# EAGLE design PiLight (EAGLE 6.4)
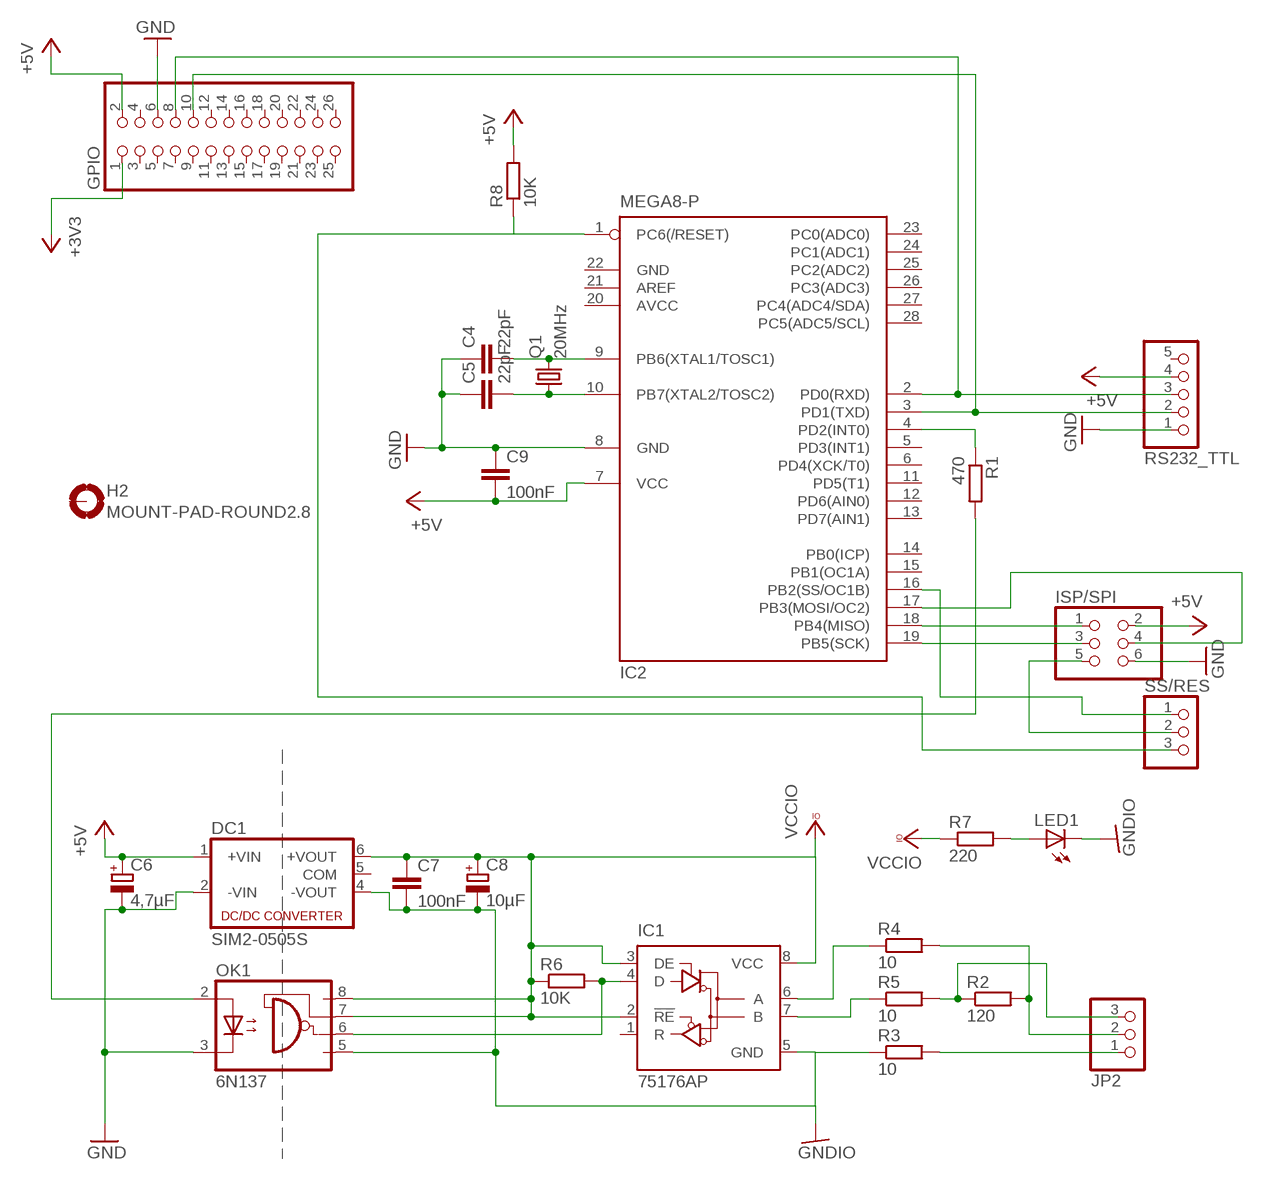
[diagram p0: schematic, sheet 1]

## Parts
C4  22pF  C-EU025-025X050  [C025-025X050]
C5  22pF  C-EU025-025X050  [C025-025X050]
C6  4,7µF  CPOL-EUE2.5-5  [E2,5-5]
C7  100nF  C-EU025-025X050  [C025-025X050]
C8  10µF  CPOL-EUE2.5-5  [E2,5-5]
C9  100nF  C-EU025-025X050  [C025-025X050]
DC1  SIM2-0505S  NMA  [NMA]
GPIO  PINHD-2X13  [2X13]
H2  MOUNT-PAD-ROUND2.8  [2,8-PAD]
IC1  75176AP  [DIL08]
IC2  MEGA8-P  [DIL28-3]
ISP/SPI  PINHD-2X3  [2X03]
JP2  PINHD-1X3  [1X03]
LED1  LED3MM  [LED3MM]
OK1  6N137  [DIL08]
Q1  20MHz  CRYSTALHC49S  [HC49/S]
R1  470  R-EU_0207/10  [0207/10]
R2  120  R-EU_0207/10  [0207/10]
R3  10  R-EU_0207/10  [0207/10]
R4  10  R-EU_0207/10  [0207/10]
R5  10  R-EU_0207/10  [0207/10]
R6  10K  R-EU_0207/10  [0207/10]
R7  220  R-EU_0207/10  [0207/10]
R8  10K  R-EU_0207/10  [0207/10]
RS232_TTL  PINHD-1X5  [1X05]
SS/RES  PINHD-1X3  [1X03]

## Nets
+3V3: GPIO.1
+5V: C6.+ C9.2 DC1.1(+VIN) GPIO.2 IC2.7(VCC) ISP/SPI.2 R8.2 RS232_TTL.4
GND: C4.1 C5.1 C6.- C9.1 DC1.2(-VIN) GPIO.6 IC2.8(GND) ISP/SPI.6 OK1.3(C) RS232_TTL.1
GNDIO: C7.2 C8.- DC1.4(-VOUT) IC1.5(GND) LED1.K(C) OK1.5(GND) R3.1
N$1: IC2.1(PC6(/RESET)) R8.1 SS/RES.3
N$2: IC2.17(PB3(MOSI/OC2)) ISP/SPI.4
N$3: IC2.18(PB4(MISO)) ISP/SPI.1
N$4: IC2.19(PB5(SCK)) ISP/SPI.3
N$5: C4.2 IC2.9(PB6(XTAL1/TOSC1)) Q1.2
N$6: GPIO.8 IC2.2(PD0(RXD)) RS232_TTL.3
N$7: GPIO.10 IC2.3(PD1(TXD)) RS232_TTL.2
N$9: ISP/SPI.5 SS/RES.2
N$10: C5.2 IC2.10(PB7(XTAL2/TOSC2)) Q1.1
N$11: IC2.16(PB2(SS/OC1B)) SS/RES.1
N$13: OK1.2(A) R1.2
N$14: LED1.A R7.2
N$16: IC2.4(PD2(INT0)) R1.1
N$17: IC1.6(A) R4.1
N$18: IC1.7(B) R5.1
N$19: JP2.1 R3.2
N$20: JP2.2 R2.2 R4.2
N$21: JP2.3 R2.1 R5.2
N$22: IC1.4(D) OK1.6(VO) R6.2
VCCIO: C7.1 C8.+ DC1.6(+VOUT) IC1.2(!RE) IC1.3(DE) IC1.8(VCC) OK1.7(VE) OK1.8(VCC) R6.1 R7.1
Unconnected: DC1.5(COM) GPIO.3 GPIO.4 GPIO.5 GPIO.7 GPIO.9 GPIO.11 GPIO.12 GPIO.13 GPIO.14 GPIO.15 GPIO.16 GPIO.17 GPIO.18 GPIO.19 GPIO.20 GPIO.21 GPIO.22 GPIO.23 GPIO.24 GPIO.25 GPIO.26 H2.B2,8(MOUNT) IC1.1(R) IC2.5(PD3(INT1)) IC2.6(PD4(XCK/T0)) IC2.11(PD5(T1)) IC2.12(PD6(AIN0)) IC2.13(PD7(AIN1)) IC2.14(PB0(ICP)) IC2.15(PB1(OC1A)) IC2.21(AREF) IC2.23(PC0(ADC0)) IC2.24(PC1(ADC1)) IC2.25(PC2(ADC2)) IC2.26(PC3(ADC3)) IC2.27(PC4(ADC4/SDA)) IC2.28(PC5(ADC5/SCL)) RS232_TTL.5

## Power pins joined to a net without a drawn wire
AVCC: IC2.20(AVCC)
GND: IC2.22(GND)

## Library data of the parts
C4 C5 C7 C9 = rcl:C-EU: CAPACITOR, European symbol
C6 C8 = rcl:CPOL-EU: POLARIZED CAPACITOR, European symbol
DC1 = dc-dc-converter:NMA: DC-DC CONVERTER; MF: C & D TECHNOLOGIES, INC; MPN: NMA0515SC; OC_FARNELL: 1021434; OC_NEWARK: 61K3064
GPIO = pinhead:PINHD-2X13: PIN HEADER
H2 = holes:MOUNT-PAD-ROUND: MOUNTING PAD, round
IC1 = 751xx:75176A: DIFFERENTIAL BUS TRANSCEIVER Source: http://focus.ti.com/lit/ds/symlink/sn75176a.pdf
IC2 = atmel:MEGA8-P: MICROCONTROLLER 8 Kbytes FLASH, 1 kbytes SRAM, 512 bytes EEPROM, USART, 4-channel 10 bit ADC, 2-channel 8 bit ADC Pin compatible with Atmega48, ATMega88, ATMega168 Source: avr.lbr; OC_FARNELL: unknown; OC_NEWARK: unknown
ISP/SPI = pinhead:PINHD-2X3: PIN HEADER
JP2 SS/RES = pinhead:PINHD-1X3: PIN HEADER
LED1 = led:LED: LED OSRAM: - CHIPLED LG R971, LG N971, LY N971, LG Q971, LY Q971, LO R971, LY R971 LH N974, LH R974 LS Q976, LO Q976, LY Q976 LO Q996 - Hyper CHIPLED LW Q18S LB Q993, LB Q99A, LB R99A - SideLED LS A670, LO A670, LY A670, LG A670, LP A670 LB A673, LV A673, LT A673, LW A673 LH A674 LY A675 LS A676, LA A676, LO A676, LY A676, LW A676 LS A679, LY A679, LG A679 - Hyper Micro SIDELED® LS Y876, LA Y876, LO Y876, LY Y876 LT Y87S - SmartLED LW L88C, LW L88S LB L89C, LB L89S, LG L890 LS L89K, LO L89K, LY L89K LS L896, LA L896, LO L896, LY L896 - TOPLED LS T670, LO T670, LY T670, LG T670, LP T670 LSG T670, LSP T670, LSY T670, LOP T670, LYG T670 LG T671, LOG T671, LSG T671 LB T673, LV T673, LT T673, LW T673 LH T674 LS T676, LA T676, LO T676, LY T676, LB T676, LH T676, LSB T676, LW T676 LB T67C, LV T67C, LT T67C, LS T67K, LO T67K, LY T67K, LW E67C LS E67B, LA E67B, LO E67B, LY E67B, LB E67C, LV E67C, LT E67C LW T67C LS T679, LY T679, LG T679 LS T770, LO T770, LY T770, LG T770, LP T770 LB T773, LV T773, LT T773, LW T773 LH T774 LS E675, LA E675, LY E675, LS T675 LS T776, LA T776, LO T776, LY T776, LB T776 LHGB T686 LT T68C, LB T68C - Hyper Mini TOPLED® LB M676 - Mini TOPLED Santana® LG M470 LS M47K, LO M47K, LY M47K Source: http://www.osram.convergy.de LUXEON: - LUMILED® LXK2-PW12-R00, LXK2-PW12-S00, LXK2-PW14-U00, LXK2-PW14-V00 LXK2-PM12-R00, LXK2-PM12-S00, LXK2-PM14-U00 LXK2-PE12-Q00, LXK2-PE12-R00, LXK2-PE12-S00, LXK2-PE14-T00, LXK2-PE14-U00 LXK2-PB12-K00, LXK2-PB12-L00, LXK2-PB12-M00, LXK2-PB14-N00, LXK2-PB14-P00, LXK2-PB14-Q00 LXK2-PR12-L00, LXK2-PR12-M00, LXK2-PR14-Q00, LXK2-PR14-R00 LXK2-PD12-Q00, LXK2-PD12-R00, LXK2-PD12-S00 LXK2-PH12-R00, LXK2-PH12-S00 LXK2-PL12-P00, LXK2-PL12-Q00, LXK2-PL12-R00 Source: www.luxeon.com KINGBRIGHT: KA-3528ASYC Source: www.kingbright.com
OK1 = optocoupler:6N137: MOTOROLA OPTO COUPLER; MPN: 6N137; OC_FARNELL: 1328376; OC_NEWARK: 52M1895
Q1 = crystal:CRYSTAL: CRYSTAL; OC_FARNELL: 1667008; OC_NEWARK: unknown
R1-R8 = rcl:R-EU_: RESISTOR, European symbol
RS232_TTL = pinhead:PINHD-1X5: PIN HEADER

## Board
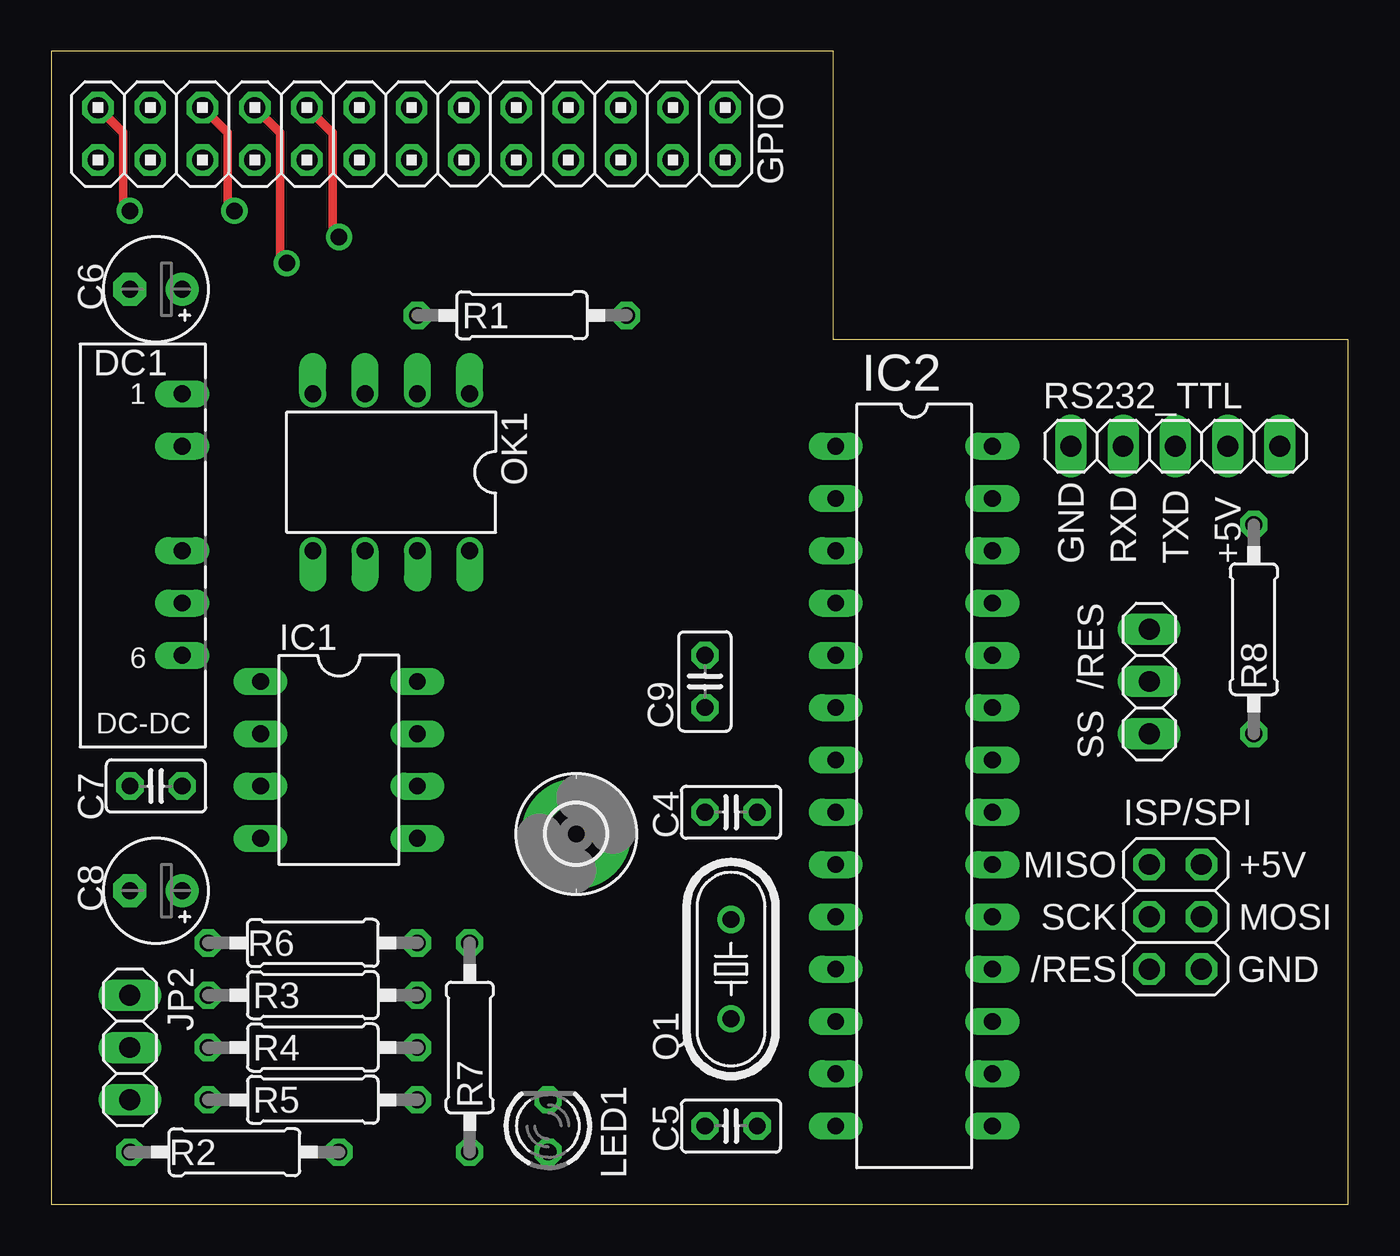
[diagram p1: board, top side]
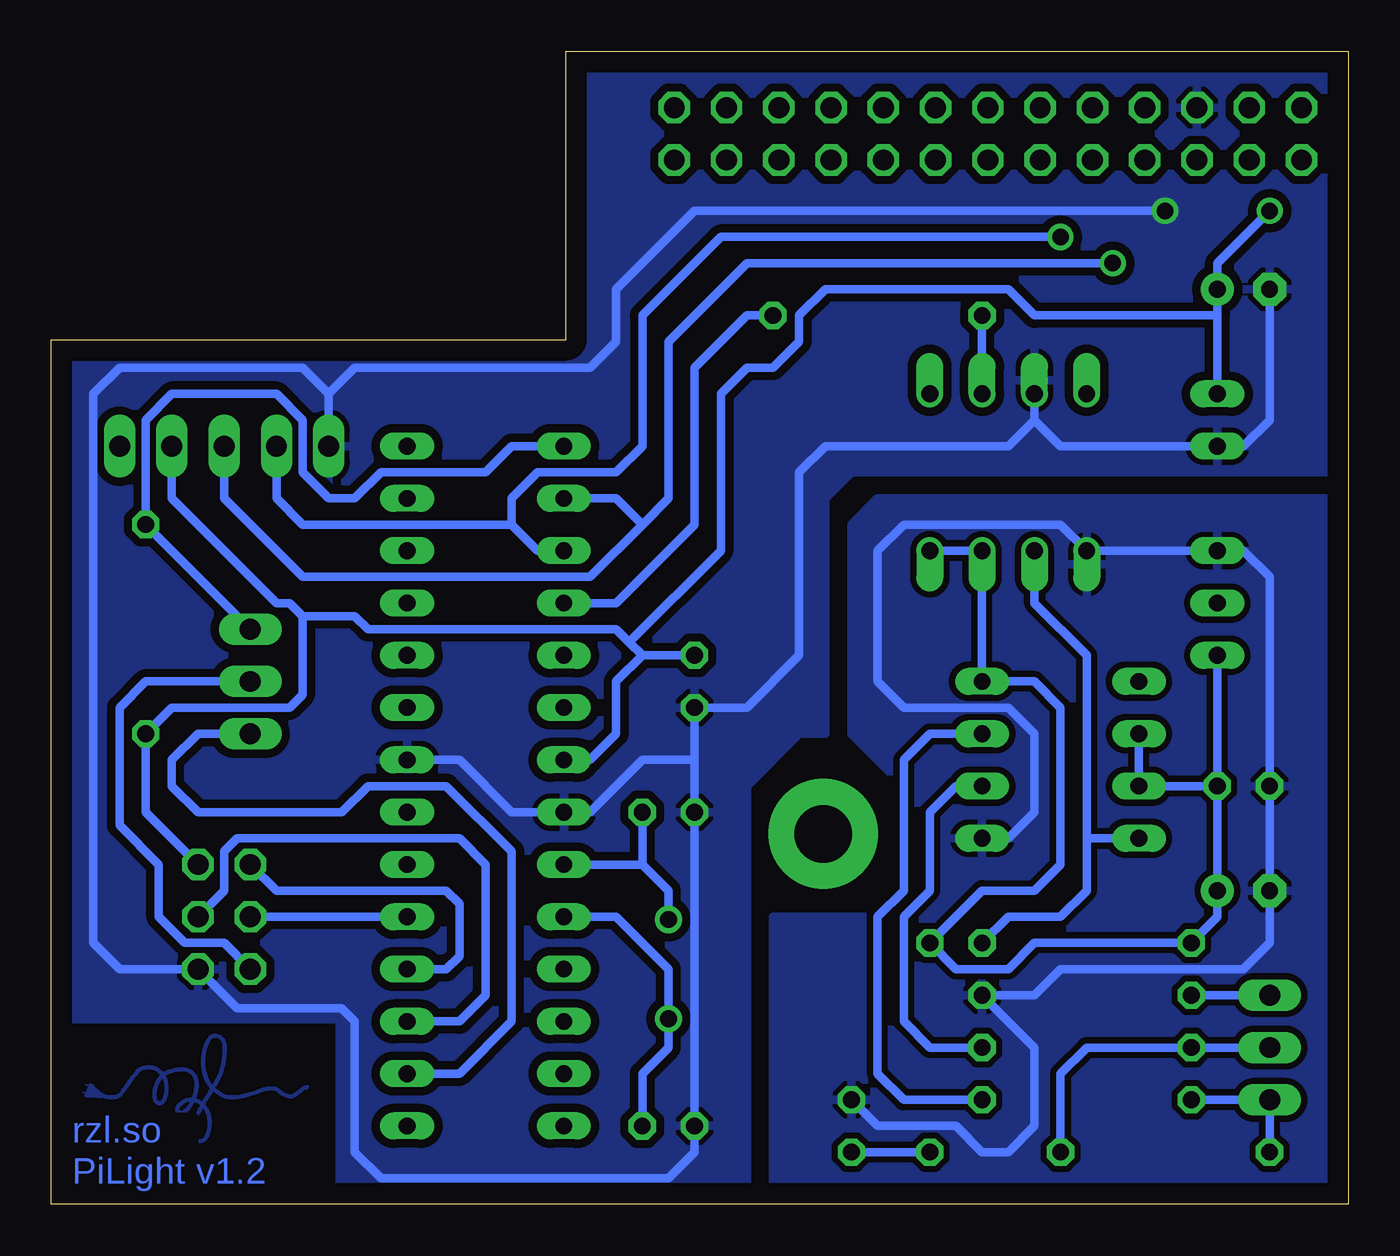
[diagram p2: board, bottom side, seen from below]

Size 63 x 56 mm. Coordinates in mm from the lower left corner, seen from the top.
Outline: 0,0 63,0 63,42 38,42 38,56 0,56 0,0
Copper layers (1*16): Top 0.035mm / dielectric 1.5mm / Bottom 0.035mm
Design rules "default": minimum track width 10mil, minimum drill 24mil, track to track 8mil, track to pad 8mil, pad to pad 8mil, via to via 8mil, smd to smd 8mil, copper to edge 40mil, drill to drill 8mil, minimum pad ring 10mil, minimum via ring 8mil, stop-mask expansion 4mil, vias tented up to drill 0mil, thermal gap 10mil

### Footprints (pad centres in the part's own frame; a part is rotated, then mirrored left to right if it is on the bottom)
C025-025X050 = drill 0.813 octagon: 1 -1.27,0; 2 1.27,0
E2,5-5 = drill 0.813 pad 1.6: + -1.27,0 | drill 0.813 pad 1.6 octagon: - 1.27,0
NMA = drill 0.813 long: 1 0,6.35; 2 0,3.81; 4 0,-1.27; 5 0,-3.81; 6 0,-6.35
2X13 = drill 1.016 octagon: 1 -15.24,-1.27; 2 -15.24,1.27; 3 -12.7,-1.27; 4 -12.7,1.27; 5 -10.16,-1.27; 6 -10.16,1.27; 7 -7.62,-1.27; 8 -7.62,1.27; 9 -5.08,-1.27; 10 -5.08,1.27; 11 -2.54,-1.27; 12 -2.54,1.27; 13 0,-1.27; 14 0,1.27; 15 2.54,-1.27; 16 2.54,1.27; 17 5.08,-1.27; 18 5.08,1.27; 19 7.62,-1.27; 20 7.62,1.27; 21 10.16,-1.27; 22 10.16,1.27; 23 12.7,-1.27; 24 12.7,1.27; 25 15.24,-1.27; 26 15.24,1.27
2,8-PAD = drill 2.8 pad 5.334: B2,8 0,0
DIL08 = drill 0.813 long: 1 -3.81,-3.81; 2 -1.27,-3.81; 3 1.27,-3.81; 4 3.81,-3.81; 5 3.81,3.81; 6 1.27,3.81; 7 -1.27,3.81; 8 -3.81,3.81
DIL28-3 = drill 0.813 long: 1 -16.51,-3.81; 2 -13.97,-3.81; 3 -11.43,-3.81; 4 -8.89,-3.81; 5 -6.35,-3.81; 6 -3.81,-3.81; 7 -1.27,-3.81; 8 1.27,-3.81; 9 3.81,-3.81; 10 6.35,-3.81; 11 8.89,-3.81; 12 11.43,-3.81; 13 13.97,-3.81; 14 16.51,-3.81; 15 16.51,3.81; 16 13.97,3.81; 17 11.43,3.81; 18 8.89,3.81; 19 6.35,3.81; 20 3.81,3.81; 21 1.27,3.81; 22 -1.27,3.81; 23 -3.81,3.81; 24 -6.35,3.81; 25 -8.89,3.81; 26 -11.43,3.81; 27 -13.97,3.81; 28 -16.51,3.81
2X03 = drill 1.016 octagon: 1 -2.54,-1.27; 2 -2.54,1.27; 3 0,-1.27; 4 0,1.27; 5 2.54,-1.27; 6 2.54,1.27
1X03 = drill 1.016 long: 1 -2.54,0; 2 0,0; 3 2.54,0
LED3MM = drill 0.813 octagon: A -1.27,0; K 1.27,0
DIL08' = drill 0.813 offset: 1 -3.81,-3.81; 2 -1.27,-3.81; 3 1.27,-3.81; 4 3.81,-3.81; 5 3.81,3.81; 6 1.27,3.81; 7 -1.27,3.81; 8 -3.81,3.81
HC49/S = drill 0.813: 1 -2.413,0; 2 2.413,0
0207/10 = drill 0.813 octagon: 1 -5.08,0; 2 5.08,0
1X05 = drill 1.016 long: 1 -5.08,0; 2 -2.54,0; 3 0,0; 4 2.54,0; 5 5.08,0

### Placement (x,y rotation side)
C4  33.02,19.05 0 top
C5  33.02,3.81 0 top
C6  5.08,44.45 180 top
C7  5.08,20.32 180 top
C8  5.08,15.24 180 top
C9  31.75,25.4 90 top
DC1  6.35,33.02 0 top
GPIO  17.5,52 0 top
H2  25.5,18 0 top
IC1  13.97,21.59 270 top
IC2  41.91,20.32 270 top
ISP/SPI  54.61,13.97 270 top
JP2  3.81,7.62 270 top
LED1  24.13,3.81 90 top
OK1  6N137  [DIL08']  16.51,35.56 180 top
Q1  33.02,11.43 90 top
R1  22.86,43.18 180 top
R2  8.89,2.54 0 top
R3  12.7,10.16 180 top
R4  12.7,7.62 180 top
R5  12.7,5.08 180 top
R6  12.7,12.7 0 top
R7  20.32,7.62 270 top
R8  58.42,27.94 270 top
RS232_TTL  54.61,36.83 0 top
SS/RES  53.34,25.4 90 top

### Tracks (layer width: path | path; a pad name or v marks a point on that pad's centre or on a via)
+5V  (via drill 0.8 pad 1.27)  (1 unrouted)
  Top 0.406: v3.81,48.26 3.49,48.58 3.49,52.07 3.46,52.07 GPIO.2
  Bottom 0.406: GPIO.2 2.29,53.27 | DC1.1 6.35,43.18 | 6.35,43.18 C6.+ 6.35,45.72 v3.81,48.26 | 6.35,43.18 15.24,43.18 16.51,44.45 25.4,44.45 26.67,43.18 26.67,41.91 27.94,40.64 29.21,40.64 30.48,39.37 30.48,31.75 34.92,27.3 | IC2.7 36.83,21.59 35.56,22.86 35.56,25.4 34.29,26.67 | RS232_TTL.4 57.15,34.29 52.07,29.21 51.44,29.21 50.8,28.57 | 34.92,27.3 34.29,26.67 | 34.92,27.3 35.56,27.94 47.62,27.94 48.26,28.57 50.8,28.57 | 34.29,26.67 C9.2 | ISP/SPI.2 58.42,19.05 R8.2 57.15,24.13 51.44,24.13 50.8,24.77 50.8,28.57
GND  (via drill 0.8 pad 1.27)
  Top 0.406: v8.89,48.26 8.57,48.58 8.57,52.07 8.54,52.07 GPIO.6
  Bottom 0.406: 31.75,21.59 C4.1 C5.1 31.75,2.54 33.02,1.27 46.99,1.27 48.26,2.54 48.26,8.89 48.9,9.53 53.98,9.53 ISP/SPI.6 59.69,11.43 60.96,12.7 60.96,39.37 59.69,40.64 50.8,40.64 49.53,39.37 | 31.75,21.59 C9.1 29.21,24.13 26.67,26.67 26.67,35.56 25.4,36.83 16.51,36.83 15.24,38.1 | 15.24,38.1 OK1.3 | 15.24,38.1 13.97,36.83 DC1.2 5.08,36.83 3.81,38.1 C6.- | GPIO.6 7.37,53.27 | 49.53,39.37 RS232_TTL.1 | v8.89,48.26 31.75,48.26 35.56,44.45 35.56,41.91 36.83,40.64 48.26,40.64 49.53,39.37 | IC2.22 43.18,21.59 40.64,19.05 IC2.8 36.83,19.05 34.29,21.59 31.75,21.59
  pour Bottom (isolate 0.406): 0,35.56 24.13,35.56 25.4,34.29 25.4,22.86 26.67,22.86 29.21,20.32 29.21,0 49,0 49,9 63,9 63,56 39.27,55.97 38.12,55.88 0,55.88
GNDIO
  Bottom 0.406: IC1.5 16.51,17.78 15.24,19.05 15.24,22.86 16.51,24.13 21.59,24.13 22.86,25.4 22.86,31.75 21.59,33.02 13.97,33.02 OK1.5 DC1.4 5.08,31.75 3.81,30.48 C7.2 C8.- 3.81,12.7 5.08,11.43 13.97,11.43 15.24,10.16 R3.1 15.24,7.62 15.24,3.81 16.51,2.54 17.78,2.54 19.05,3.81 22.86,3.81 LED1.K
  pour Bottom (isolate 0.305): 0,34.29 22.86,34.29 24.13,33.02 24.13,22.86 21.59,20.32 21.59,15.24 22.86,13.97 27.94,13.97 27.94,0 0,0
N$1
  Bottom 0.406: IC2.1 40.64,36.83 41.91,35.56 46.99,35.56 48.26,34.29 49.53,34.29 50.8,35.56 50.8,38.1 52.07,39.37 57.15,39.37 58.42,38.1 R8.1 SS/RES.3
N$2
  Bottom 0.406: ISP/SPI.4 54.61,15.24 54.61,17.14 53.98,17.78 43.18,17.78 41.91,16.51 41.91,10.16 43.18,8.89 IC2.17
N$3
  Bottom 0.406: IC2.18 43.81,11.43 43.18,12.06 43.18,14.61 43.81,15.24 52.07,15.24 ISP/SPI.1
N$4
  Bottom 0.406: IC2.19 ISP/SPI.3
N$5
  Bottom 0.406: Q1.2 33.02,15.24 34.29,16.51 | 34.29,16.51 C4.2 | 34.29,16.51 IC2.9
N$6  (via drill 0.8 pad 1.27)
  Top 0.406: v11.43,45.72 11.11,46.04 11.11,52.07 11.08,52.07 GPIO.8
  Bottom 0.406: GPIO.8 9.91,53.27 | v11.43,45.72 29.21,45.72 33.02,41.91 33.02,34.29 34.29,33.02 | 34.29,33.02 35.56,34.29 IC2.2 | 34.29,33.02 36.83,30.48 50.8,30.48 54.61,34.29 RS232_TTL.3
N$7  (via drill 0.8 pad 1.27)
  Top 0.406: v13.97,46.99 13.65,47.31 13.65,52.07 13.62,52.07 GPIO.10
  Bottom 0.406: GPIO.10 12.45,53.27 | v13.97,46.99 30.48,46.99 34.29,43.18 34.29,36.83 35.56,35.56 39.37,35.56 40.64,34.29 40.64,33.02 | RS232_TTL.2 52.07,34.29 50.8,33.02 40.64,33.02 | 40.64,33.02 39.37,31.75 IC2.3
N$8
  pour Bottom: 819 corners
N$9
  Bottom 0.406: ISP/SPI.5 54.61,12.7 56.52,12.7 57.78,13.97 57.78,16.51 59.69,18.41 59.69,24.13 58.42,25.4 SS/RES.2
N$10
  Bottom 0.406: C5.2 34.29,6.35 33.02,7.62 Q1.1 33.02,11.43 35.56,13.97 IC2.10
N$11
  Bottom 0.406: IC2.16 43.18,6.35 40.64,8.89 40.64,17.14 43.81,20.32 47.62,20.32 48.9,19.05 55.88,19.05 57.15,20.32 57.15,21.59 55.88,22.86 SS/RES.1
N$13
  Bottom 0.406: OK1.2 R1.2
N$14
  Bottom 0.406: R7.2 LED1.A
N$16
  Bottom 0.406: R1.1 29.21,43.18 31.75,40.64 31.75,33.02 35.56,29.21 IC2.4
N$17
  Bottom 0.406: IC1.6 19.05,20.32 20.32,19.05 20.32,15.24 21.59,13.97 21.59,8.89 20.32,7.62 R4.1
N$18
  Bottom 0.406: IC1.7 20.32,22.86 21.59,21.59 21.59,15.24 22.86,13.97 22.86,6.35 21.59,5.08 R5.1
N$19
  Bottom 0.406: JP2.1 R3.2
N$20
  Bottom 0.406: JP2.2 R4.2 12.7,7.62 13.97,6.35 R2.2
N$21
  Bottom 0.406: R5.2 JP2.3 R2.1
N$22
  Bottom 0.406: 12.7,17.78 12.7,26.67 15.24,29.21 OK1.6 | 12.7,17.78 IC1.4 | 12.7,17.78 12.7,15.24 13.97,13.97 16.51,13.97 R6.2
VCCIO
  Bottom 0.406: OK1.8 OK1.7 IC1.8 15.24,25.4 13.97,24.13 13.97,16.51 15.24,15.24 17.78,15.24 R7.1 19.05,11.43 16.51,11.43 15.24,12.7 R6.1 6.35,13.97 C8.+ C7.1 | C7.1 DC1.6 | C7.1 IC1.3 IC1.2

### Text on the board
Bottom: rzl.so | PiLight v1.2
tNames: GND | RXD | TXD | +5V | SS /RES | MISO | +5V | SCK | MOSI | /RES | GND
fancy: rzl.so | PiLight v1.2